# EAGLE schematic Arduino_DUE_X_V02d-2Layer (EAGLE 7.1.0)
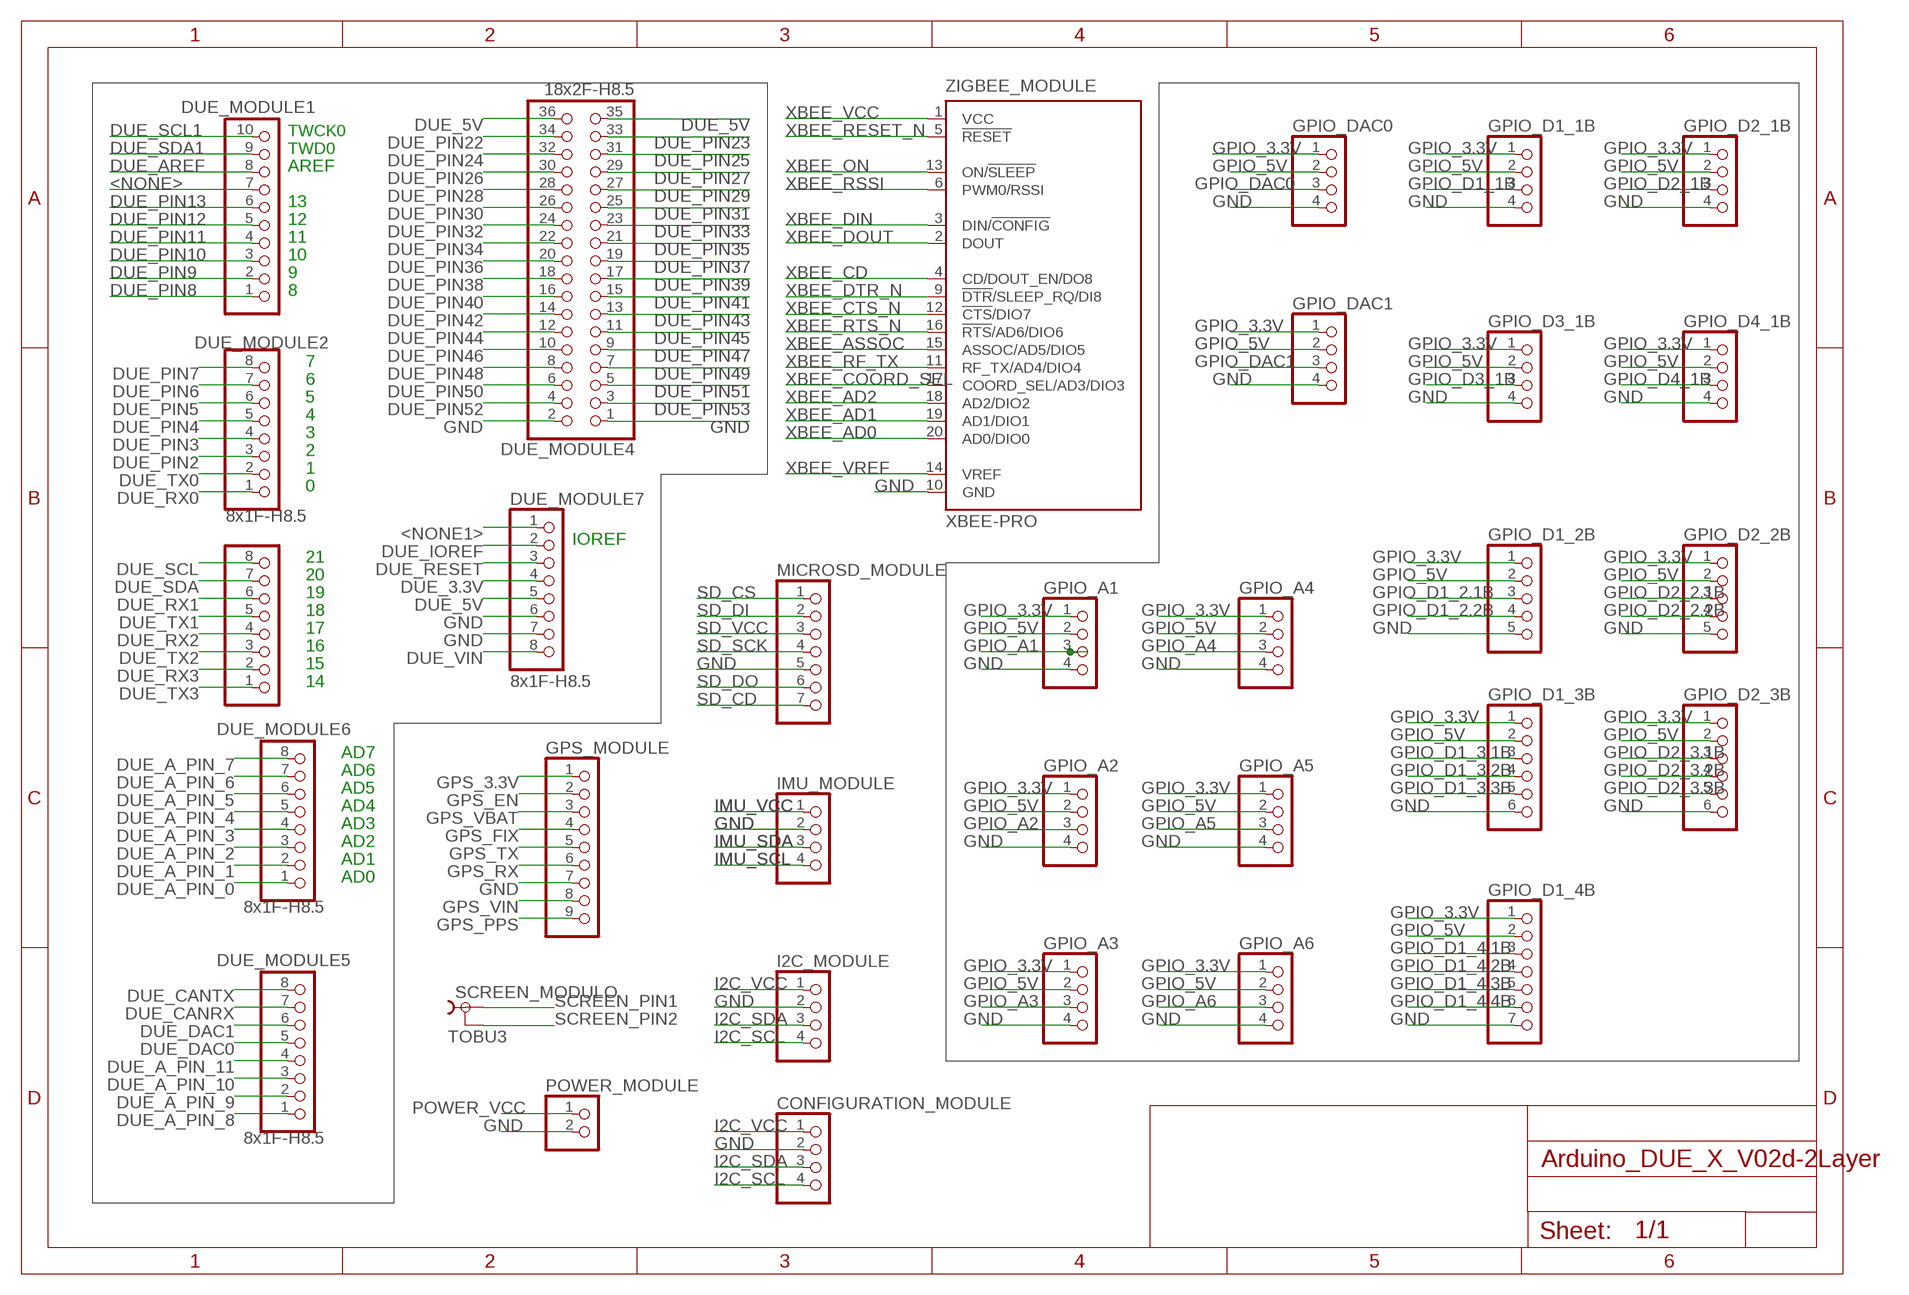
[diagram p0: schematic, sheet 1]

## Parts
CONFIGURATION_MODULE  PINHD-1X4  [1X04]
DUE_MODULE1  10x1F-H8.5  PINHD-1X10  [1X10]
DUE_MODULE2  8x1F-H8.5  PINHD-1X8  [1X08]
DUE_MODULE3  8x1F-H8.5  PINHD-1X8  [1X08]
DUE_MODULE4  18x2F-H8.5  PINHD-2X18  [2X18]
DUE_MODULE5  8x1F-H8.5  PINHD-1X8  [1X08]
DUE_MODULE6  8x1F-H8.5  PINHD-1X8  [1X08]
DUE_MODULE7  8x1F-H8.5  PINHD-1X8  [1X08]
GPIO_A1  PINHD-1X4/90  [1X04/90]
GPIO_A2  PINHD-1X4/90  [1X04/90]
GPIO_A3  PINHD-1X4/90  [1X04/90]
GPIO_A4  PINHD-1X4/90  [1X04/90]
GPIO_A5  PINHD-1X4/90  [1X04/90]
GPIO_A6  PINHD-1X4/90  [1X04/90]
GPIO_D1_1B  PINHD-1X4/90  [1X04/90]
GPIO_D1_2B  PINHD-1X5/90  [1X05/90]
GPIO_D1_3B  PINHD-1X6/90  [1X06/90]
GPIO_D1_4B  PINHD-1X7/90  [1X07/90]
GPIO_D2_1B  PINHD-1X4/90  [1X04/90]
GPIO_D2_2B  PINHD-1X5/90  [1X05/90]
GPIO_D2_3B  PINHD-1X6/90  [1X06/90]
GPIO_D3_1B  PINHD-1X4/90  [1X04/90]
GPIO_D4_1B  PINHD-1X4/90  [1X04/90]
GPIO_DAC0  PINHD-1X4/90  [1X04/90]
GPIO_DAC1  PINHD-1X4/90  [1X04/90]
GPS_MODULE  PINHD-1X9  [1X09]
I2C_MODULE  PINHD-1X4  [1X04]
IMU_MODULE  PINHD-1X4  [1X04]
MICROSD_MODULE  PINHD-1X7  [1X07]
POWER_MODULE  PINHD-1X2  [1X02]
SCREEN_MODULO  TOBU3  [TOBU3]
ZIGBEE_MODULE  XBEE-PRO  [XBEE-PRO]

## Nets
<NONE1>: DUE_MODULE7.1
<NONE>: DUE_MODULE1.7
DUE_3.3V: DUE_MODULE7.4
DUE_5V: DUE_MODULE4.35 DUE_MODULE4.36 DUE_MODULE7.5
DUE_A_PIN_0: DUE_MODULE6.1
DUE_A_PIN_1: DUE_MODULE6.2
DUE_A_PIN_2: DUE_MODULE6.3
DUE_A_PIN_3: DUE_MODULE6.4
DUE_A_PIN_4: DUE_MODULE6.5
DUE_A_PIN_5: DUE_MODULE6.6
DUE_A_PIN_6: DUE_MODULE6.7
DUE_A_PIN_7: DUE_MODULE6.8
DUE_A_PIN_8: DUE_MODULE5.1
DUE_A_PIN_9: DUE_MODULE5.2
DUE_A_PIN_10: DUE_MODULE5.3
DUE_A_PIN_11: DUE_MODULE5.4
DUE_AREF: DUE_MODULE1.8
DUE_CANRX: DUE_MODULE5.7
DUE_CANTX: DUE_MODULE5.8
DUE_DAC0: DUE_MODULE5.5
DUE_DAC1: DUE_MODULE5.6
DUE_IOREF: DUE_MODULE7.2
DUE_PIN2: DUE_MODULE2.3
DUE_PIN3: DUE_MODULE2.4
DUE_PIN4: DUE_MODULE2.5
DUE_PIN5: DUE_MODULE2.6
DUE_PIN6: DUE_MODULE2.7
DUE_PIN7: DUE_MODULE2.8
DUE_PIN8: DUE_MODULE1.1
DUE_PIN9: DUE_MODULE1.2
DUE_PIN10: DUE_MODULE1.3
DUE_PIN11: DUE_MODULE1.4
DUE_PIN12: DUE_MODULE1.5
DUE_PIN13: DUE_MODULE1.6
DUE_PIN22: DUE_MODULE4.34
DUE_PIN23: DUE_MODULE4.33
DUE_PIN24: DUE_MODULE4.32
DUE_PIN25: DUE_MODULE4.31
DUE_PIN26: DUE_MODULE4.30
DUE_PIN27: DUE_MODULE4.29
DUE_PIN28: DUE_MODULE4.28
DUE_PIN29: DUE_MODULE4.27
DUE_PIN30: DUE_MODULE4.26
DUE_PIN31: DUE_MODULE4.25
DUE_PIN32: DUE_MODULE4.24
DUE_PIN33: DUE_MODULE4.23
DUE_PIN34: DUE_MODULE4.22
DUE_PIN35: DUE_MODULE4.21
DUE_PIN36: DUE_MODULE4.20
DUE_PIN37: DUE_MODULE4.19
DUE_PIN38: DUE_MODULE4.18
DUE_PIN39: DUE_MODULE4.17
DUE_PIN40: DUE_MODULE4.16
DUE_PIN41: DUE_MODULE4.15
DUE_PIN42: DUE_MODULE4.14
DUE_PIN43: DUE_MODULE4.13
DUE_PIN44: DUE_MODULE4.12
DUE_PIN45: DUE_MODULE4.11
DUE_PIN46: DUE_MODULE4.10
DUE_PIN47: DUE_MODULE4.9
DUE_PIN48: DUE_MODULE4.8
DUE_PIN49: DUE_MODULE4.7
DUE_PIN50: DUE_MODULE4.6
DUE_PIN51: DUE_MODULE4.5
DUE_PIN52: DUE_MODULE4.4
DUE_PIN53: DUE_MODULE4.3
DUE_RESET: DUE_MODULE7.3
DUE_RX0: DUE_MODULE2.1
DUE_RX1: DUE_MODULE3.6
DUE_RX2: DUE_MODULE3.4
DUE_RX3: DUE_MODULE3.2
DUE_SCL: DUE_MODULE3.8
DUE_SCL1: DUE_MODULE1.10
DUE_SDA: DUE_MODULE3.7
DUE_SDA1: DUE_MODULE1.9
DUE_TX0: DUE_MODULE2.2
DUE_TX1: DUE_MODULE3.5
DUE_TX2: DUE_MODULE3.3
DUE_TX3: DUE_MODULE3.1
DUE_VIN: DUE_MODULE7.8
GND [gnd]: CONFIGURATION_MODULE.2 DUE_MODULE4.1 DUE_MODULE4.2 DUE_MODULE7.6 DUE_MODULE7.7 GPIO_A1.4 GPIO_A2.4 GPIO_A3.4 GPIO_A4.4 GPIO_A5.4 GPIO_A6.4 GPIO_D1_1B.4 GPIO_D1_2B.5 GPIO_D1_3B.6 GPIO_D1_4B.7 GPIO_D2_1B.4 GPIO_D2_2B.5 GPIO_D2_3B.6 GPIO_D3_1B.4 GPIO_D4_1B.4 GPIO_DAC0.4 GPIO_DAC1.4 GPS_MODULE.7 I2C_MODULE.2 IMU_MODULE.2 MICROSD_MODULE.5 POWER_MODULE.2 ZIGBEE_MODULE.10(GND)
GPIO_3.3V: GPIO_A1.1 GPIO_A2.1 GPIO_A3.1 GPIO_A4.1 GPIO_A5.1 GPIO_A6.1 GPIO_D1_1B.1 GPIO_D1_2B.1 GPIO_D1_3B.1 GPIO_D1_4B.1 GPIO_D2_1B.1 GPIO_D2_2B.1 GPIO_D2_3B.1 GPIO_D3_1B.1 GPIO_D4_1B.1 GPIO_DAC0.1 GPIO_DAC1.1
GPIO_5V: GPIO_A1.2 GPIO_A2.2 GPIO_A3.2 GPIO_A4.2 GPIO_A5.2 GPIO_A6.2 GPIO_D1_1B.2 GPIO_D1_2B.2 GPIO_D1_3B.2 GPIO_D1_4B.2 GPIO_D2_1B.2 GPIO_D2_2B.2 GPIO_D2_3B.2 GPIO_D3_1B.2 GPIO_D4_1B.2 GPIO_DAC0.2 GPIO_DAC1.2
GPIO_A1: GPIO_A1.3
GPIO_A2: GPIO_A2.3
GPIO_A3: GPIO_A3.3
GPIO_A4: GPIO_A4.3
GPIO_A5: GPIO_A5.3
GPIO_A6: GPIO_A6.3
GPIO_D1_1B: GPIO_D1_1B.3
GPIO_D1_2.1B: GPIO_D1_2B.3
GPIO_D1_2.2B: GPIO_D1_2B.4
GPIO_D1_3.1B: GPIO_D1_3B.3
GPIO_D1_3.2B: GPIO_D1_3B.4
GPIO_D1_3.3B: GPIO_D1_3B.5
GPIO_D1_4.1B: GPIO_D1_4B.3
GPIO_D1_4.2B: GPIO_D1_4B.4
GPIO_D1_4.3B: GPIO_D1_4B.5
GPIO_D1_4.4B: GPIO_D1_4B.6
GPIO_D2_1B: GPIO_D2_1B.3
GPIO_D2_2.1B: GPIO_D2_2B.3
GPIO_D2_2.2B: GPIO_D2_2B.4
GPIO_D2_3.1B: GPIO_D2_3B.3
GPIO_D2_3.2B: GPIO_D2_3B.4
GPIO_D2_3.3B: GPIO_D2_3B.5
GPIO_D3_1B: GPIO_D3_1B.3
GPIO_D4_1B: GPIO_D4_1B.3
GPIO_DAC0: GPIO_DAC0.3
GPIO_DAC1: GPIO_DAC1.3
GPS_3.3V: GPS_MODULE.1
GPS_EN: GPS_MODULE.2
GPS_FIX: GPS_MODULE.4
GPS_PPS: GPS_MODULE.9
GPS_RX: GPS_MODULE.6
GPS_TX: GPS_MODULE.5
GPS_VBAT: GPS_MODULE.3
GPS_VIN: GPS_MODULE.8
I2C_SCL: CONFIGURATION_MODULE.4 I2C_MODULE.4
I2C_SDA: CONFIGURATION_MODULE.3 I2C_MODULE.3
I2C_VCC: CONFIGURATION_MODULE.1 I2C_MODULE.1
IMU_SCL: IMU_MODULE.4
IMU_SDA: IMU_MODULE.3
IMU_VCC: IMU_MODULE.1
POWER_VCC: POWER_MODULE.1
SCREEN_PIN1: SCREEN_MODULO.1
SCREEN_PIN2: SCREEN_MODULO.2 SCREEN_MODULO.2@1 SCREEN_MODULO.2@2
SD_CD: MICROSD_MODULE.7
SD_CS: MICROSD_MODULE.1
SD_DI: MICROSD_MODULE.2
SD_DO: MICROSD_MODULE.6
SD_SCK: MICROSD_MODULE.4
SD_VCC: MICROSD_MODULE.3
XBEE_AD0: ZIGBEE_MODULE.20(AD0/DIO0)
XBEE_AD1: ZIGBEE_MODULE.19(AD1/DIO1)
XBEE_AD2: ZIGBEE_MODULE.18(AD2/DIO2)
XBEE_ASSOC: ZIGBEE_MODULE.15(ASSOC/AD5/DIO5)
XBEE_CD: ZIGBEE_MODULE.4(CD/DOUT_EN/DO8)
XBEE_COORD_SEL: ZIGBEE_MODULE.17(COORD_SEL/AD3/DIO3)
XBEE_CTS_N: ZIGBEE_MODULE.12(!CTS!/DIO7)
XBEE_DIN: ZIGBEE_MODULE.3(DIN/!CONFIG)
XBEE_DOUT: ZIGBEE_MODULE.2(DOUT)
XBEE_DTR_N: ZIGBEE_MODULE.9(!DTR!/SLEEP_RQ/DI8)
XBEE_ON: ZIGBEE_MODULE.13(ON/!SLEEP)
XBEE_RESET_N: ZIGBEE_MODULE.5(!RESET)
XBEE_RF_TX: ZIGBEE_MODULE.11(RF_TX/AD4/DIO4)
XBEE_RSSI: ZIGBEE_MODULE.6(PWM0/RSSI)
XBEE_RTS_N: ZIGBEE_MODULE.16(!RTS!/AD6/DIO6)
XBEE_VCC: ZIGBEE_MODULE.1(VCC)
XBEE_VREF: ZIGBEE_MODULE.14(VREF)

## Notes on the sheet
- TWCK0
- TWD0
- AREF
- 13
- 12
- 11
- 10
- 9
- 8
- 7
- 6
- 5
- 4
- 3
- 2
- 1
- 0
- IOREF
- 21
- 20
- 19
- 18
- 17
- 16
- 15
- 14
- AD7
- AD6
- AD5
- AD4
- AD3
- AD2
- AD1
- AD0

## Library data of the parts
CONFIGURATION_MODULE GPIO_A1-GPIO_A6 GPIO_D1_1B GPIO_D2_1B GPIO_D3_1B GPIO_D4_1B GPIO_DAC0 GPIO_DAC1 I2C_MODULE IMU_MODULE = pinhead:PINHD-1X4: PIN HEADER
DUE_MODULE1 = SmartPrj:PINHD-1X10: PIN HEADER
DUE_MODULE2 DUE_MODULE3 DUE_MODULE5-DUE_MODULE7 = SmartPrj:PINHD-1X8: PIN HEADER
DUE_MODULE4 = SmartPrj:PINHD-2X18: PIN HEADER
GPIO_D1_2B GPIO_D2_2B = pinhead:PINHD-1X5: PIN HEADER
GPIO_D1_3B GPIO_D2_3B = pinhead:PINHD-1X6: PIN HEADER
GPIO_D1_4B MICROSD_MODULE = pinhead:PINHD-1X7: PIN HEADER
GPS_MODULE = pinhead:PINHD-1X9: PIN HEADER
POWER_MODULE = pinhead:PINHD-1X2: PIN HEADER
SCREEN_MODULO = con-hirschmann:TOBU3: Female Cinch CONNECTOR ( RCA Jack ); MF: FARNELL; MPN: TOBU 3; OC_FARNELL: 592791; OC_NEWARK: 06WX5914
ZIGBEE_MODULE = maxstream:XBEE: XBee (TM) /XBee-PRO(TM) OEM RF Modules Source: MaxStream, Inc. xbee_productmanual.pdf; MPN: XBP24-AWI-001; OC_FARNELL: 1337916; OC_NEWARK: 42M2667

## Module INPUT
Ports: 

### Library data of the parts

## Net classes
0 default: width 0.203 mm, drill 0.406 mm, clearance 0.203 mm
1 USB: width 0.203 mm, drill 0.406 mm, clearance 0.203 mm
2 gnd: width 0.203 mm, drill 0.406 mm, clearance 0.203 mm
3 usbvcc: width 0.203 mm, drill 0.406 mm, clearance 0.203 mm
4 USBpair: width 0.254 mm, drill 0.406 mm, clearance 0.61 mm